# Altium schematic sheet connector.SchDoc
size A4
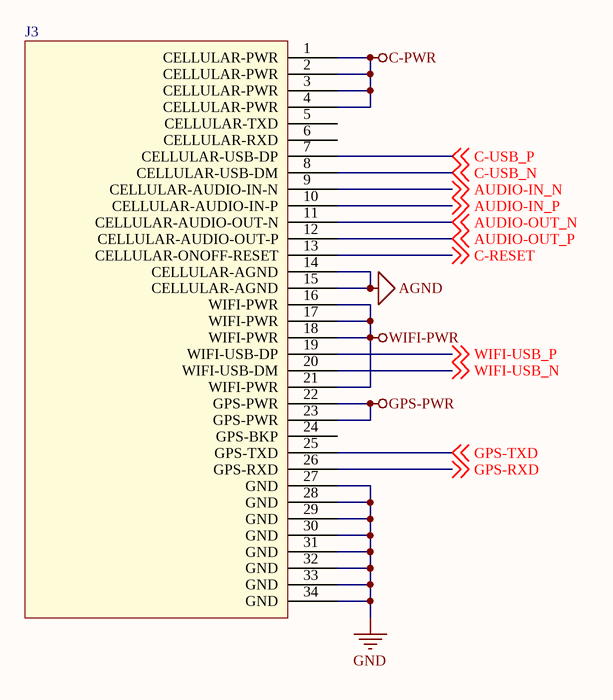
[diagram p0: connector.SchDoc]

## Parts
J3  COMM_BOARD  [HEAD_2MM_2X17]  (value not drawn)

## Nets
AGND: J3.14(CELLULAR-AGND) J3.15(CELLULAR-AGND)
C-PWR: J3.1(CELLULAR-PWR) J3.2(CELLULAR-PWR) J3.3(CELLULAR-PWR) J3.4(CELLULAR-PWR)
GND: J3.27(GND) J3.28(GND) J3.29(GND) J3.30(GND) J3.31(GND) J3.32(GND) J3.33(GND) J3.34(GND)
GPS-PWR: J3.22(GPS-PWR) J3.23(GPS-PWR)
WIFI-PWR: J3.16(WIFI-PWR) J3.17(WIFI-PWR) J3.18(WIFI-PWR) J3.21(WIFI-PWR)
AUDIO-IN_N: J3.9(CELLULAR-AUDIO-IN-N) ; off-sheet AUDIO-IN_N
AUDIO-IN_P: J3.10(CELLULAR-AUDIO-IN-P) ; off-sheet AUDIO-IN_P
AUDIO-OUT_N: J3.11(CELLULAR-AUDIO-OUT-N) ; off-sheet AUDIO-OUT_N
AUDIO-OUT_P: J3.12(CELLULAR-AUDIO-OUT-P) ; off-sheet AUDIO-OUT_P
C-RESET: J3.13(CELLULAR-ONOFF-RESET) ; off-sheet C-RESET
C-USB_N: J3.8(CELLULAR-USB-DM) ; off-sheet C-USB_N
C-USB_P: J3.7(CELLULAR-USB-DP) ; off-sheet C-USB_P
GPS-RXD: J3.26(GPS-RXD) ; off-sheet GPS-RXD
GPS-TXD: J3.25(GPS-TXD) ; off-sheet GPS-TXD
WIFI-USB_N: J3.20(WIFI-USB-DM) ; off-sheet WIFI-USB_N
WIFI-USB_P: J3.19(WIFI-USB-DP) ; off-sheet WIFI-USB_P

Not connected (* = marked no-connect by the designer): J3 5(CELLULAR-TXD) 6(CELLULAR-RXD) 24(GPS-BKP)